# EAGLE schematic PCB_power_glider_v13 (EAGLE 9.7.0)
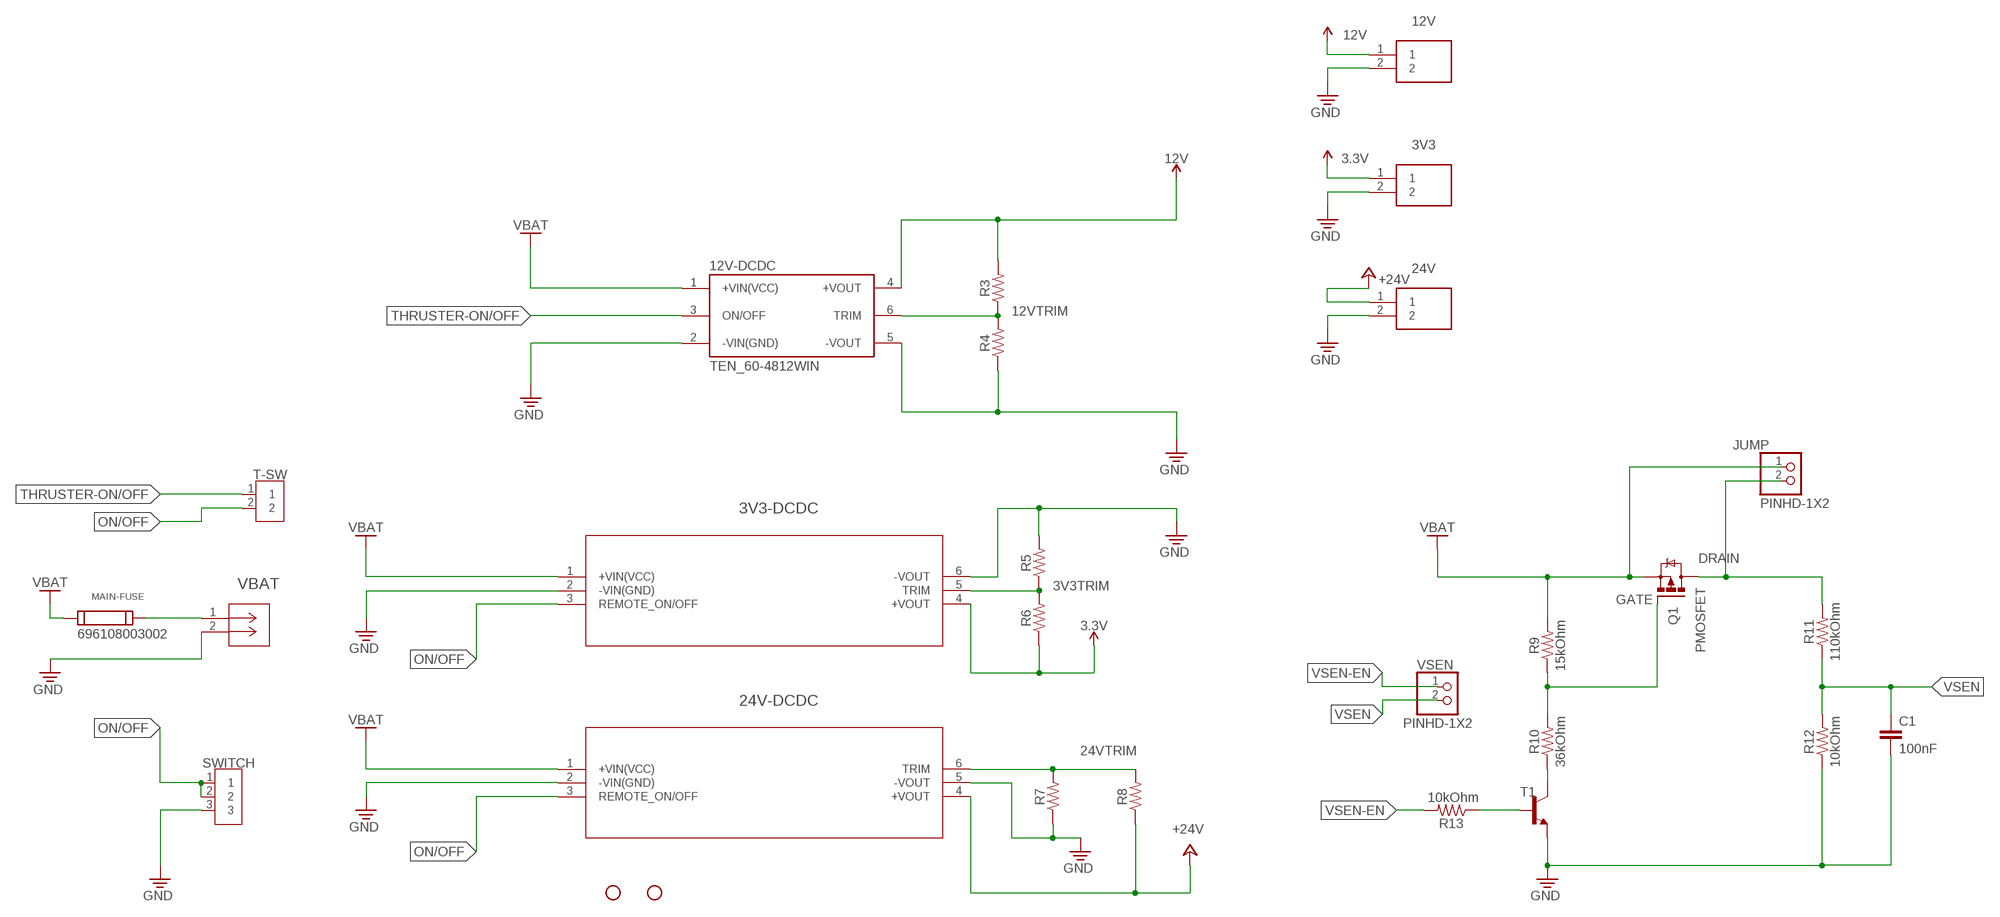
[diagram p0: schematic, sheet 1]

## Parts
3V3  CTBP0508_2  [CTBP05082]
3V3-DCDC  THN_20-4810WIRTHN_20WIR_SINGLE_TRP  [THN_20WIR_SINGLE_TRP]
12V  CTBP0508_2  [CTBP05082]
12V-DCDC  TEN_60-4812WIN  [CONV_TEN_60-4812WIN]
24V  CTBP0508_2  [CTBP05082]
24V-DCDC  TEN_60-4815WINTEN_60WIN_TRP  [TEN_60WIN_TRP]
C1  100nF  CAP-0603  [0603]
H1  STAND-OFFTIGHT  [STAND-OFF-TIGHT]
H4  STAND-OFFTIGHT  [STAND-OFF-TIGHT]
JUMP  PINHD-1X2  [1X02]
MAIN-FUSE  696108003002  [696108003002]
Q1  PMOSFET  PMOSFET_SOT23-GSD  [SOT23]
R3  RESISTOR0603  [0603]
R4  RESISTOR0603  [0603]
R5  RESISTOR0603  [0603]
R6  RESISTOR0603  [0603]
R7  RESISTOR0603  [0603]
R8  RESISTOR0603  [0603]
R9  15kOhm  RESISTOR0603  [0603]
R10  36kOhm  RESISTOR0603  [0603]
R11  110kOhm  RESISTOR0603  [0603]
R12  10kOhm  RESISTOR0603  [0603]
R13  10kOhm  RESISTOR0603  [0603]
SWITCH  2828XX-3282834-3  [TERMBLK_254-3N]
T1  -NPN-SOT23-EBC  [SOT23-EBC]
T-SW  2828XX-2282834-2  [TERMBLK_254-2N]
VBAT  NC6-P107-02CONN2_1437664-4_TEC  [CONN2_1437664-4_TEC]
VSEN  PINHD-1X2  [1X02]

## Nets
3.3V: 3V3-DCDC.4(+VOUT) 3V3.1 R6.1
3V3TRIM: 3V3-DCDC.5(TRIM) R5.1 R6.2
12V: 12V-DCDC.4(+VOUT) 12V.1 R3.2
12VTRIM: 12V-DCDC.6(TRIM) R3.1 R4.2
24VTRIM: 24V-DCDC.6(TRIM) R7.2 R8.2
+24V: 24V-DCDC.4(+VOUT) 24V.1 R8.1
DRAIN: JUMP.2 Q1.3(D) R11.2
GATE: Q1.1(G) R9.1 R10.2
GND [New Class]: 3V3-DCDC.2(-VIN(GND)) 3V3-DCDC.6(-VOUT) 3V3.2 12V-DCDC.2(-VIN(GND)) 12V-DCDC.5(-VOUT) 12V.2 24V-DCDC.2(-VIN(GND)) 24V-DCDC.5(-VOUT) 24V.2 C1.2 R4.1 R5.2 R7.1 R12.1 SWITCH.3 T1.E VBAT.2
N$3: MAIN-FUSE.2 VBAT.1
N$11: R10.1 T1.C
N$12: R13.1 T1.B
ON/OFF: 3V3-DCDC.3(REMOTE_ON/OFF) 24V-DCDC.3(REMOTE_ON/OFF) SWITCH.1 SWITCH.2 T-SW.2
THRUSTER-ON/OFF: 12V-DCDC.3(ON/OFF) T-SW.1
VBAT: 3V3-DCDC.1(+VIN(VCC)) 12V-DCDC.1(+VIN(VCC)) 24V-DCDC.1(+VIN(VCC)) JUMP.1 MAIN-FUSE.1 Q1.2(S) R9.2
VSEN: C1.1 R11.1 R12.2 VSEN.2
VSEN-EN: R13.2 VSEN.1

## Library data of the parts
3V3 12V 24V = CTBP0508_2:CTBP0508_2: Conn Terminal Block F 2 POS 5.08mm Solder ST Thru-Hole 8A Source: Datasheet <https://static6.arrow.com/aropdfconversion/9b5fc771929c7e0117b52de15994f93b42c84896/ctbp0508_series_d.pdf>; DESCRIPTION: Conn Terminal Block F 2 POS 5.08mm Solder ST Thru-Hole 8A; HEIGHT: 10.2mm; MANUFACTURER_NAME: CAMDENBOSS; MANUFACTURER_PART_NUMBER: CTBP0508/2
3V3-DCDC = TRACO_THN 20-4810WIR_Library:THN_20-4810WIR; COPYRIGHT: Copyright (C) 2024 Ultra Librarian. All rights reserved.; MANUFACTURER_PART_NUMBER: THN 20-4810WIR; MFR_NAME: Traco Power
12V-DCDC = TEN_60-4812WIN:TEN_60-4812WIN: Check availability <https://pricing.snapeda.com/parts/TEN%2060-4812WIN/Traco%20Power/view-part?ref=eda>; AVAILABILITY: In Stock; CHECK_PRICES: https://www.snapeda.com/parts/TEN%2060-4812WIN/Traco+Power/view-part/?ref=eda; DESCRIPTION: 60 Watt DC/DC converter, industrial, 4:1 input, encapsulated, 2 x 1 metal package; MF: Traco Power; MP: TEN 60-4812WIN; PACKAGE: 2&quot; X 1&quot; Traco Power; PRICE: None; PURCHASE-URL: https://www.snapeda.com/api/url_track_click_mouser/?unipart_id=2783815&manufacturer=Traco Power&part_name=TEN 60-4812WIN&search_term=ten 60-4812win; SNAPEDA_LINK: https://www.snapeda.com/parts/TEN%2060-4812WIN/Traco+Power/view-part/?ref=snap
24V-DCDC = TRACO_TEN-60-4815WIN_Library:TEN_60-4815WIN; COPYRIGHT: Copyright (C) 2024 Ultra Librarian. All rights reserved.; MANUFACTURER_PART_NUMBER: TEN 60-4815WIN; MFR_NAME: Traco Power
C1 = SparkFun-Capacitors:CAP
H1 H4 = SparkFun-Hardware:STAND-OFF: Stand Off Drill holes for mechanically mounting via screws, standoffs, etc. Note: Use the keepout ring to avoid running the screw head into surrounding components. Variant Overviews STAND-OFF - Mechanical footprint for a #4 phillips button head screw. STAND-OFF-TIGHT - Mechanical footprint for a #4 phillips button head screw, Example SparkFun Products Screw - Phillips Head (1/4", 4-40, 10 pack) <https://www.sparkfun.com/products/10453> (PRT-10453) Screw - Phillips Head (1/2", 4-40, 10 pack) <https://www.sparkfun.com/products/10452> (PRT-10452) Screw - Phillips Head (3/4", 4-40, 10 pack) <https://www.sparkfun.com/products/10451> (PRT-10451) Screw - Phillips Head (1", 4-40, 10 pack) <https://www.sparkfun.com/products/10450> (PRT-10450)
JUMP VSEN = Connector:PINHD-1X2: PIN HEADER; CATEGORY: Headers; DESCRIPTION: Header, Straight, 2 Position; MANUFACTURER: Generic; MPN: Generic; OPERATING_TEMPERATURE: Generic; PART_STATUS: Active; PITCH: 0.100" (2.54mm); ROHS_COMPLIANCE: Generic; SERIES: Generic; SUB-CATEGORY: Headers, Male Pins; TYPE: Board to Board or Cable, Unshrouded, Through Hole, Straight
MAIN-FUSE = Wurth_Connectors_WR-FSH:696108003002: WR-FSH Fuseholder THT Blocks PCB Clip Cover MATERIAL PROPERTIES Insulator Material PA66 Insulator Flammability Rating UL94 V-0 Insulator Color Green Contact Material Copper Alloy Contact Plating Tin over Nickel Contact Type Stamped GENERAL INFORMATION Operating Temperature -30 up to +120 °C Compliance RoHS ELECTRICAL PROPERTIES IR UL 20 A IR VDE 6.3 A Working Voltage [UL] 250 V (AC) Working Voltage [VDE] 250 V (AC) Withstanding Voltage [UL] 1500 V (AC) Withstanding Voltage [cULus] 1500 V (AC) Withstanding Voltage [VDE] 1500 V (AC) Contact Resistance 10 mΩ Contact Resistance [VDE] 10 mΩ MECHANICAL PROPERTIES Protection Class I & II Fuse Size 5x20 mm CERTIFICATION cULus Approval E157417 VDE Approval 129302 PACKAGING PROPERTIES Packaging Box <https://katalog.we-online.com/media/images/v2/o33102v209%20Family_WR-FSH_69610X003002.jpg> Details see: https://katalog.we-online.com/en/em/FSH_THT_PCB_CLIP_COVER_69610X003002 Updated by Ella Wu 2019-10-25 2019 (C) Wurth Elektronik; DATASHEET-URL: https://www.we-online.com/catalog/datasheet/696108003002.pdf; IR-UL: 20A; IR-VDE: 6.3A; MATES: 696122003001; PART-NUMBER: 696108003002
Q1 = Transistor:PMOSFET: P-Channel MOSFET - Generic; CATEGORY: Transistor; SUB-CATEGORY: MOSFET; TYPE: P-Channel
R3-R13 = SparkFun-Resistors:RESISTOR: Generic Resistor Package
SWITCH = Connector:2828XX-3: 3 Position Wire to Board Terminal Block Horizontal with Board Datasheet <https://www.te.com.cn/commerce/DocumentDelivery/DDEController?Action=showdoc&DocId=Catalog+Section%7F1308389_EUROSTYLE_TERMINAL_BLOCKS%7F0607%7Fpdf%7FEnglish%7FENG_CS_1308389_EUROSTYLE_TERMINAL_BLOCKS_0607.pdf%7F2-282837-5>; CATEGORY: Fixed Terminal Blocks; DESCRIPTION: Fixed Terminal Blocks 3P TERMINAL BLOCK; MANUFACTURER: TE Connectivity AMP Connectors; MPN: 282834-3; OPERATING_TEMPERATURE: -40°C ~ 105°C; PART_STATUS: Active; PITCH: 0.100" (2.54mm); ROHS_COMPLIANCE: RoHS Compliant; SERIES: Buchanan; SUBCATEGORY: Terminal Blocks; TYPE: Through Hole; Screw - Rising Cage Clamp; Side wire entry, Horizontal with Board
T1 = transistor:*-NPN-: NPN Transistror BF959 corrected 2008.03.06
T-SW = Connector:2828XX-2: 2 Position Wire to Board Terminal Block Horizontal with Board Datasheet <https://www.te.com.cn/commerce/DocumentDelivery/DDEController?Action=showdoc&DocId=Catalog+Section%7F1308389_EUROSTYLE_TERMINAL_BLOCKS%7F0607%7Fpdf%7FEnglish%7FENG_CS_1308389_EUROSTYLE_TERMINAL_BLOCKS_0607.pdf%7F2-282837-5>; CATEGORY: Fixed Terminal Blocks; DESCRIPTION: Fixed Terminal Blocks 2P SIDE ENTRY 2.54mm; MANUFACTURER: TE Connectivity AMP Connectors; MPN: 282834-2; OPERATING_TEMPERATURE: -40°C ~ 105°C; PART_STATUS: Active; PITCH: 0.100" (2.54mm); ROHS_COMPLIANCE: RoHS Compliant; SERIES: Buchanan; SUBCATEGORY: Terminal Blocks; TYPE: Through Hole; Screw - Rising Cage Clamp; Side wire entry, Horizontal with Board
VBAT = 2pos_barrierstrip_Library:NC6-P107-02; COPYRIGHT: Copyright (C) 2024 Ultra Librarian. All rights reserved.; MANUFACTURER_PART_NUMBER: NC6-P107-02; MFR_NAME: TE Connectivity